# EAGLE design SUMO_AUTO (EAGLE 9.6.2)
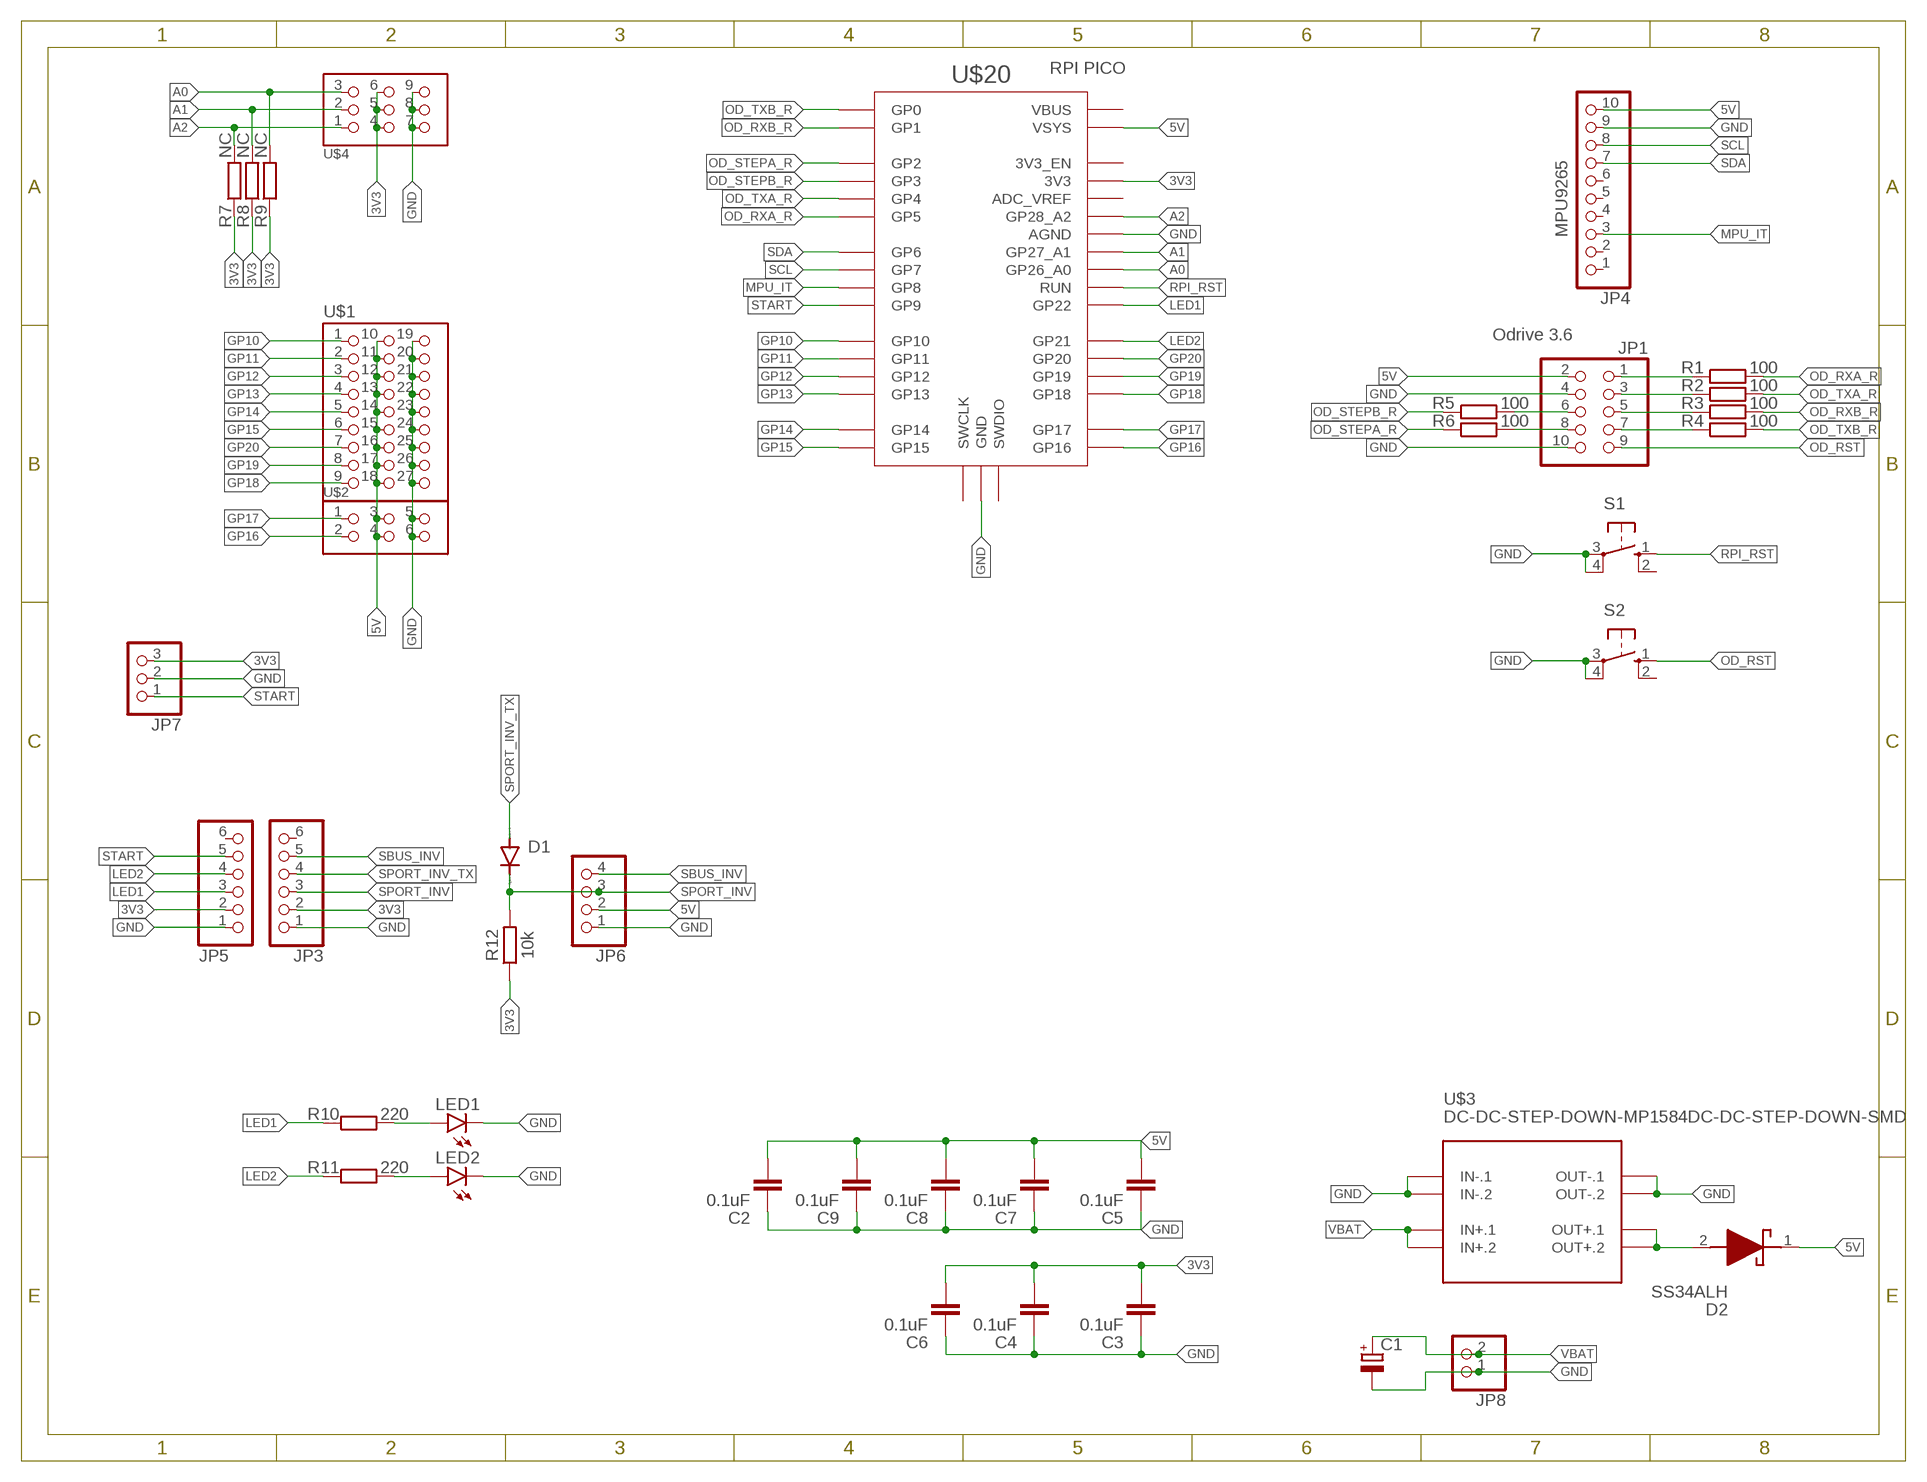
[diagram p0: schematic, sheet 1]

## Parts
C1  C-POL_TANTALUM-2920(7443-METRIC)  [CAPMP7443X430N]
C2  0.1uF  C_CHIP-0805(2012-METRIC)  [0805]
C3  0.1uF  C_CHIP-0805(2012-METRIC)  [0805]
C4  0.1uF  C_CHIP-0805(2012-METRIC)  [0805]
C5  0.1uF  C_CHIP-0805(2012-METRIC)  [0805]
C6  0.1uF  C_CHIP-0805(2012-METRIC)  [0805]
C7  0.1uF  C_CHIP-0805(2012-METRIC)  [0805]
C8  0.1uF  C_CHIP-0805(2012-METRIC)  [0805]
C9  0.1uF  C_CHIP-0805(2012-METRIC)  [0805]
D1  BAT81  [DO34-7]
D2  SS34ALH  [SODFL5226X100N]
JP1  PINHD-2X5  [2X05]
JP3  PINHD-1X6  [1X06]
JP4  PINHD-1X10  [1X10]
JP5  PINHD-1X6  [1X06]
JP6  PINHD-1X4  [1X04]
JP7  PINHD-1X3  [1X03]
JP8  PINHD-1X2  [1X02]
LED1  LEDCHIP-LED0805  [CHIP-LED0805]
LED2  LEDCHIP-LED0805  [CHIP-LED0805]
R1  100  R_CHIP-0805(2012-METRIC)  [0805]
R2  100  R_CHIP-0805(2012-METRIC)  [0805]
R3  100  R_CHIP-0805(2012-METRIC)  [0805]
R4  100  R_CHIP-0805(2012-METRIC)  [0805]
R5  100  R_CHIP-0805(2012-METRIC)  [0805]
R6  100  R_CHIP-0805(2012-METRIC)  [0805]
R7  NC  R_CHIP-0805(2012-METRIC)  [0805]
R8  NC  R_CHIP-0805(2012-METRIC)  [0805]
R9  NC  R_CHIP-0805(2012-METRIC)  [0805]
R10  220  R_CHIP-0805(2012-METRIC)  [0805]
R11  220  R_CHIP-0805(2012-METRIC)  [0805]
R12  10k  R_CHIP-0805(2012-METRIC)  [0805]
S1  10-XX  [B3F-10XX]
S2  10-XX  [B3F-10XX]
U$1  PIN_3X9  [PIN_3X9]
U$2  PIN_3X2  [PIN_3X2]
U$3  DC-DC-STEP-DOWN-MP1584DC-DC-STEP-DOWN-SMD  [DC-DC-STEP-DOWN-SMD]
U$4  PIN_3X3  [PIN_3X3]
U$20  RPI_PICO-SMD  [RPI_PICO]

## Nets
3V3: C3.2 C4.2 C6.2 JP3.2 JP5.2 JP7.3 R7.1 R8.1 R9.1 R12.1 U$4.4 U$4.5 U$4.6 U$20.3V3
5V: C2.2 C5.2 C7.2 C8.2 C9.2 D2.1(K) JP1.2 JP4.10 JP6.2 U$1.10 U$1.11 U$1.12 U$1.13 U$1.14 U$1.15 U$1.16 U$1.17 U$1.18 U$2.3 U$2.4 U$20.VSYS
5V_REG: D2.2(A) U$3.OUT+.1 U$3.OUT+.2
A0: R9.2 U$4.3 U$20.GP26_A0
A1: R8.2 U$4.2 U$20.GP27_A1
A2: R7.2 U$4.1 U$20.GP28_A2
GND: C1.2(-) C2.1 C3.1 C4.1 C5.1 C6.1 C7.1 C8.1 C9.1 JP1.4 JP1.10 JP3.1 JP4.9 JP5.1 JP6.1 JP7.2 JP8.1 LED1.C LED2.C S1.3(P) S1.4(P1) S2.3(P) S2.4(P1) U$1.19 U$1.20 U$1.21 U$1.22 U$1.23 U$1.24 U$1.25 U$1.26 U$1.27 U$2.5 U$2.6 U$3.IN-.1 U$3.IN-.2 U$3.OUT-.1 U$3.OUT-.2 U$4.7 U$4.8 U$4.9 U$20.AGND U$20.GND@1(GND) U$20.GND@2(GND) U$20.GND@3(GND) U$20.GND@4(GND) U$20.GND@5(GND) U$20.GND@6(GND) U$20.GND@7(GND) U$20.GND@8(GND)
GP10: U$1.1 U$20.GP10
GP11: U$1.2 U$20.GP11
GP12: U$1.3 U$20.GP12
GP13: U$1.4 U$20.GP13
GP14: U$1.5 U$20.GP14
GP15: U$1.6 U$20.GP15
GP16: U$2.2 U$20.GP16
GP17: U$2.1 U$20.GP17
GP18: U$1.9 U$20.GP18
GP19: U$1.8 U$20.GP19
GP20: U$1.7 U$20.GP20
LED1: JP5.3 R10.1 U$20.GP22
LED1R: LED1.A R10.2
LED2: JP5.4 R11.1 U$20.GP21
LED2R: LED2.A R11.2
MPU_IT: JP4.3 U$20.GP8
OD_RST: JP1.9 S2.1(S)
OD_RXA: JP1.1 R1.1
OD_RXA_R: R1.2 U$20.GP5
OD_RXB: JP1.5 R3.1
OD_RXB_R: R3.2 U$20.GP1
OD_STEPA: JP1.8 R6.2
OD_STEPA_R: R6.1 U$20.GP2
OD_STEPB: JP1.6 R5.2
OD_STEPB_R: R5.1 U$20.GP3
OD_TXA: JP1.3 R2.1
OD_TXA_R: R2.2 U$20.GP4
OD_TXB: JP1.7 R4.1
OD_TXB_R: R4.2 U$20.GP0
RPI_RST: S1.1(S) U$20.RUN
SBUS_INV: JP3.5 JP6.4
SCL: JP4.8 U$20.GP7
SDA: JP4.7 U$20.GP6
SPORT_INV: D1.C JP3.3 JP6.3 R12.2
SPORT_INV_TX: D1.A JP3.4
START: JP5.5 JP7.1 U$20.GP9
VBAT: C1.1(+) JP8.2 U$3.IN+.1 U$3.IN+.2
Unconnected: JP3.6 JP4.1 JP4.2 JP4.4 JP4.5 JP4.6 JP5.6 S1.2(S1) S2.2(S1) U$20.3V3_EN U$20.ADC_VREF U$20.SWCLK U$20.SWDIO U$20.VBUS

## Notes on the sheet
- RPI PICO
- MPU9265
- Odrive 3.6

## Library data of the parts
C1 = Capacitor_edit:C-POL: Capacitor Polarised - Generic; CATEGORY: Capacitor
C2-C9 = Capacitor_edit:C: Capacitor - Generic; CATEGORY: Capacitor; JLCPCB-PART: C14663
D1 = diode:BAT81: DIODE barrier diode
D2 = SS34ALH:SS34ALH: Schottky Diodes & Rectifiers 3A, 40V, Schottky Rectifier Source: Datasheet <https://services.ts.com.tw/storage/resources/datasheet/SS34ALH SERIES_B2103.pdf>; DESCRIPTION: Schottky Diodes & Rectifiers 3A, 40V, Schottky Rectifier; HEIGHT: 1mm; MANUFACTURER_NAME: Taiwan Semiconductor; MANUFACTURER_PART_NUMBER: SS34ALH; MOUSER_PART_NUMBER: 821-SS34ALH; MOUSER_PRICE-STOCK: https://www.mouser.co.uk/ProductDetail/Taiwan-Semiconductor/SS34ALH?qs=A6eO%252BMLsxmQip%2FrgNup6RA%3D%3D
JP1 = pinhead:PINHD-2X5: PIN HEADER
JP3 JP5 = pinhead:PINHD-1X6: PIN HEADER
JP4 = pinhead:PINHD-1X10: PIN HEADER
JP6 = pinhead:PINHD-1X4: PIN HEADER
JP7 = pinhead:PINHD-1X3: PIN HEADER
JP8 = pinhead:PINHD-1X2: PIN HEADER
LED1 LED2 = led:LED: LED OSRAM: - CHIPLED LG R971, LG N971, LY N971, LG Q971, LY Q971, LO R971, LY R971 LH N974, LH R974 LS Q976, LO Q976, LY Q976 LO Q996 - Hyper CHIPLED LW Q18S LB Q993, LB Q99A, LB R99A - SideLED LS A670, LO A670, LY A670, LG A670, LP A670 LB A673, LV A673, LT A673, LW A673 LH A674 LY A675 LS A676, LA A676, LO A676, LY A676, LW A676 LS A679, LY A679, LG A679 - Hyper Micro SIDELED® LS Y876, LA Y876, LO Y876, LY Y876 LT Y87S - SmartLED LW L88C, LW L88S LB L89C, LB L89S, LG L890 LS L89K, LO L89K, LY L89K LS L896, LA L896, LO L896, LY L896 - TOPLED LS T670, LO T670, LY T670, LG T670, LP T670 LSG T670, LSP T670, LSY T670, LOP T670, LYG T670 LG T671, LOG T671, LSG T671 LB T673, LV T673, LT T673, LW T673 LH T674 LS T676, LA T676, LO T676, LY T676, LB T676, LH T676, LSB T676, LW T676 LB T67C, LV T67C, LT T67C, LS T67K, LO T67K, LY T67K, LW E67C LS E67B, LA E67B, LO E67B, LY E67B, LB E67C, LV E67C, LT E67C LW T67C LS T679, LY T679, LG T679 LS T770, LO T770, LY T770, LG T770, LP T770 LB T773, LV T773, LT T773, LW T773 LH T774 LS E675, LA E675, LY E675, LS T675 LS T776, LA T776, LO T776, LY T776, LB T776 LHGB T686 LT T68C, LB T68C - Hyper Mini TOPLED® LB M676 - Mini TOPLED Santana® LG M470 LS M47K, LO M47K, LY M47K Source: http://www.osram.convergy.de LUXEON: - LUMILED® LXK2-PW12-R00, LXK2-PW12-S00, LXK2-PW14-U00, LXK2-PW14-V00 LXK2-PM12-R00, LXK2-PM12-S00, LXK2-PM14-U00 LXK2-PE12-Q00, LXK2-PE12-R00, LXK2-PE12-S00, LXK2-PE14-T00, LXK2-PE14-U00 LXK2-PB12-K00, LXK2-PB12-L00, LXK2-PB12-M00, LXK2-PB14-N00, LXK2-PB14-P00, LXK2-PB14-Q00 LXK2-PR12-L00, LXK2-PR12-M00, LXK2-PR14-Q00, LXK2-PR14-R00 LXK2-PD12-Q00, LXK2-PD12-R00, LXK2-PD12-S00 LXK2-PH12-R00, LXK2-PH12-S00 LXK2-PL12-P00, LXK2-PL12-Q00, LXK2-PL12-R00 Source: www.luxeon.com KINGBRIGHT: KA-3528ASYC Source: www.kingbright.com
R1-R12 = Resistor_edit:R: Resistor Fixed - Generic; CATEGORY: Resistor; SUB-CATEGORY: Fixed
S1 S2 = switch-omron:10-XX: OMRON SWITCH; MPN: B3F-1000; OC_FARNELL: 176432; OC_NEWARK: 36M3542
U$1 = pinhead_3row:PIN_3X9
U$2 = pinhead_3row:PIN_3X2
U$3 = 00_personal:DC-DC-STEP-DOWN-MP1584: DC/DC Step-Down Regulator based on MP1584 chip MP1584 datasheet available here: http://www.haoyuelectronics.com/Attachment/MP1584/MP1584.pdf Click here to find device on ebay.com <http://www.ebay.com/sch/mp1584+module>
U$4 = pinhead_3row:PIN_3X3
U$20 = RaspberryPi_Pico:RPI_PICO

## Board
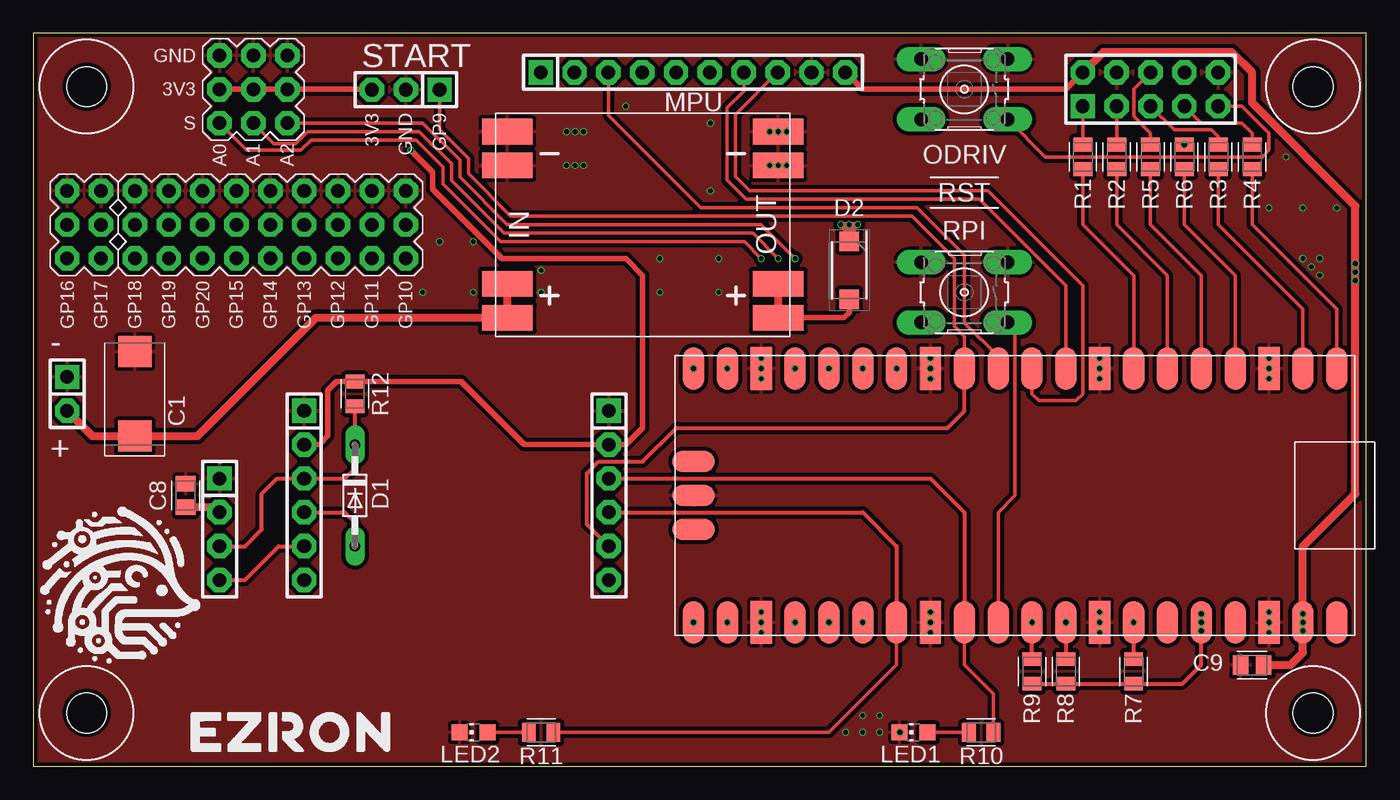
[diagram p1: board, top side]
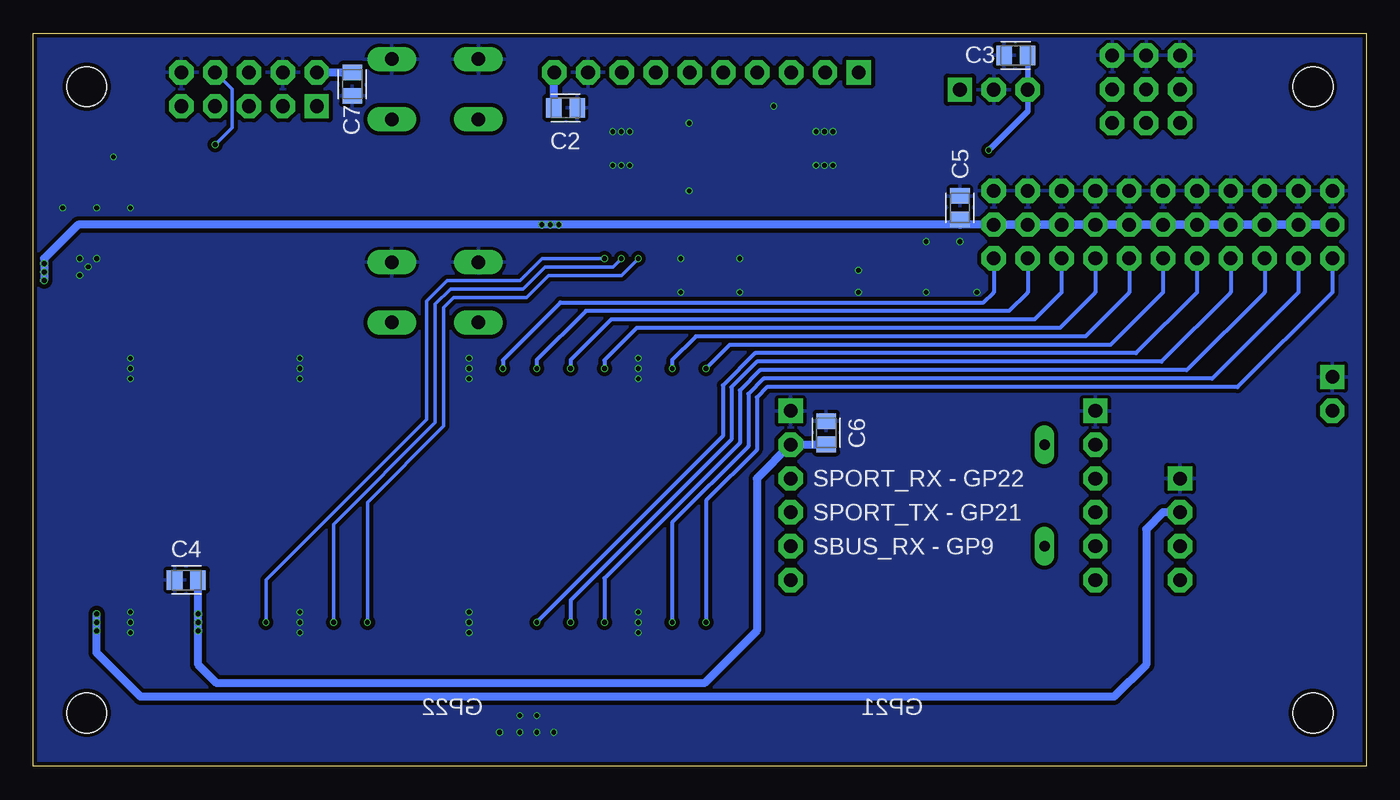
[diagram p2: board, bottom side, seen from below]

Size 100 x 55 mm. Coordinates in mm from the lower left corner, seen from the top.
Outline: 100,0 100,55 0,55 0,0 100,0
Copper layers (1*16): Top 0.035mm / dielectric 1.6mm / Bottom 0.035mm
Design rules "PCBway *": minimum track width 5mil, minimum drill 0.3mm, track to track 6mil, track to pad 6mil, pad to pad 6mil, via to via 6mil, smd to smd 6mil, copper to edge 0.3mm, drill to drill 6mil, minimum pad ring 10mil, minimum via ring 3mil, stop-mask expansion 4mil, vias tented up to drill 15mil, thermal gap 10mil
Holes 3 mm at 4,51 4,4 96,4 96,51

### Footprints (pad centres in the part's own frame; a part is rotated, then mirrored left to right if it is on the bottom)
CAPMP7443X430N = smd 2.333 x 2.515: 1 -3.166,0; 2 3.166,0
0805 = smd 1.165 x 1.465: 1 -0.875,0; 2 0.875,0
DO34-7 = drill 0.813 long: A 3.81,0; C -3.81,0
SODFL5226X100N = smd 1.45 x 1.49: 1 -2.175,0; 2 2.175,0
2X05 = drill 1.016 square: 1 -5.08,-1.27 | drill 1.016 octagon: 2 -5.08,1.27; 3 -2.54,-1.27; 4 -2.54,1.27; 5 0,-1.27; 6 0,1.27; 7 2.54,-1.27; 8 2.54,1.27; 9 5.08,-1.27; 10 5.08,1.27
1X06 = drill 1.016 square: 1 -6.35,0 | drill 1.016 octagon: 2 -3.81,0; 3 -1.27,0; 4 1.27,0; 5 3.81,0; 6 6.35,0
1X10 = drill 1.016 square: 1 -11.43,0 | drill 1.016 octagon: 2 -8.89,0; 3 -6.35,0; 4 -3.81,0; 5 -1.27,0; 6 1.27,0; 7 3.81,0; 8 6.35,0; 9 8.89,0; 10 11.43,0
1X04 = drill 1.016 square: 1 -3.81,0 | drill 1.016 octagon: 2 -1.27,0; 3 1.27,0; 4 3.81,0
1X03 = drill 1.016 square: 1 -2.54,0 | drill 1.016 octagon: 2 0,0; 3 2.54,0
1X02 = drill 1.016 square: 1 -1.27,0 | drill 1.016 octagon: 2 1.27,0
CHIP-LED0805 = smd 1.2 x 1.2: A 0,-1.05; C 0,1.05
0805' = smd 1.031 x 1.42: 1 -0.919,0; 2 0.919,0
B3F-10XX = drill 1.016 long: 1 -3.251,2.261; 2 3.251,2.261; 3 -3.251,-2.261; 4 3.251,-2.261
PIN_3X9 = drill 1.016 octagon: 1 1.27,-1.27; 2 3.81,-1.27; 3 6.35,-1.27; 4 8.89,-1.27; 5 11.43,-1.27; 6 13.97,-1.27; 7 16.51,-1.27; 8 19.05,-1.27; 9 21.59,-1.27; 10 1.27,-3.81; 11 3.81,-3.81; 12 6.35,-3.81; 13 8.89,-3.81; 14 11.43,-3.81; 15 13.97,-3.81; 16 16.51,-3.81; 17 19.05,-3.81; 18 21.59,-3.81; 19 1.27,-6.35; 20 3.81,-6.35; 21 6.35,-6.35; 22 8.89,-6.35; 23 11.43,-6.35; 24 13.97,-6.35; 25 16.51,-6.35; 26 19.05,-6.35; 27 21.59,-6.35
PIN_3X2 = drill 1.016 octagon: 1 1.27,-1.27; 2 3.81,-1.27; 3 1.27,-3.81; 4 3.81,-3.81; 5 1.27,-6.35; 6 3.81,-6.35
DC-DC-STEP-DOWN-SMD = smd 3.81 x 1.93: IN+.1 -10.16,-4.445; IN+.2 -10.16,-6.985; IN-.1 -10.16,6.985; IN-.2 -10.16,4.445; OUT+.1 10.16,-4.445; OUT+.2 10.16,-6.985; OUT-.1 10.16,6.985; OUT-.2 10.16,4.445
PIN_3X3 = drill 1.016 octagon: 1 1.27,-1.27; 2 3.81,-1.27; 3 6.35,-1.27; 4 1.27,-3.81; 5 3.81,-3.81; 6 6.35,-3.81; 7 1.27,-6.35; 8 3.81,-6.35; 9 6.35,-6.35
RPI_PICO = smd 3.2 x 1.6: 3V3 9.525,13.97; 3V3_EN 9.525,16.51; ADC_VREF 9.525,11.43; AGND 9.525,6.35; GND@1 -9.525,19.05; GND@2 -9.525,6.35; GND@3 -9.525,-6.35; GND@4 -9.525,-19.05; GND@6 9.525,-19.05; GND@7 9.525,-6.35; GND@8 9.525,19.05; GP0 -9.525,24.13; GP1 -9.525,21.59; GP2 -9.525,16.51; GP3 -9.525,13.97; GP4 -9.525,11.43; GP5 -9.525,8.89; GP6 -9.525,3.81; GP7 -9.525,1.27; GP8 -9.525,-1.27; GP9 -9.525,-3.81; GP10 -9.525,-8.89; GP11 -9.525,-11.43; GP12 -9.525,-13.97; GP13 -9.525,-16.51; GP14 -9.525,-21.59; GP15 -9.525,-24.13; GP16 9.525,-24.13; GP17 9.525,-21.59; GP18 9.525,-16.51; GP19 9.525,-13.97; GP20 9.525,-11.43; GP21 9.525,-8.89; GP22 9.525,-3.81; GP26_A0 9.525,1.27; GP27_A1 9.525,3.81; GP28_A2 9.525,8.89; RUN 9.525,-1.27; VBUS 9.525,24.13; VSYS 9.525,21.59 | smd 1.6 x 3.2: GND@5 0,-24.13; SWCLK -2.54,-24.13; SWDIO 2.54,-24.13

### Placement (x,y rotation side)
C1  7.62,27.94 90 top
C2  60.07,49.4 180 bottom
C3  26.29,53.34 0 bottom
C4  88.52,13.97 0 bottom
C5  30.48,41.91 270 bottom
C6  40.51,25.02 270 bottom
C7  76.07,51.18 90 bottom
C8  11.43,20.32 270 top
C9  91.44,7.59 0 top
D1  24.13,20.32 270 top
D2  61.21,37.21 270 top
JP1  83.82,50.8 0 top
JP3  20.32,20.32 270 top
JP4  49.49,52.07 0 top
JP5  43.18,20.32 270 top
JP6  13.97,17.78 270 top
JP7  27.94,50.77 180 top
JP8  2.54,27.94 270 top
LED1  66.04,2.54 90 top
LED2  33.02,2.54 90 top
R1  100  [0805']  78.74,45.72 270 top
R2  100  [0805']  81.28,45.72 270 top
R3  100  [0805']  88.9,45.72 270 top
R4  100  [0805']  91.44,45.72 270 top
R5  100  [0805']  83.82,45.72 90 top
R6  100  [0805']  86.36,45.72 90 top
R7  NC  [0805']  82.55,7.11 90 top
R8  NC  [0805']  77.47,7.11 90 top
R9  NC  [0805']  74.93,7.11 90 top
R10  220  [0805']  71.12,2.54 180 top
R11  220  [0805']  38.1,2.54 180 top
R12  10k  [0805']  24.13,27.94 270 top
S1  69.85,35.56 180 top
S2  69.85,50.8 180 top
U$1  29.21,36.83 180 top
U$2  6.35,36.83 180 top
U$3  45.72,40.64 0 top
U$4  20.32,46.99 180 top
U$20  73.66,20.32 270 top

### Tracks (layer width: path | path; a pad name or v marks a point on that pad's centre or on a via)
3V3  (via drill 0.35)
  Top 0.305: R9.1 R8.1 R7.1 86.2,6.19 87.63,7.62 v87.63,10.16 U$20.3V3
  Top 0.406: JP3.2 21.46,24.13 22.1,24.77 22.1,28.19 22.76,28.86 R12.1 32.1,28.86 36.83,24.13 JP5.2 44.45,24.13 45.72,25.4 45.72,36.83 44.45,38.1 35.18,38.1 29.97,43.31 29.97,44.58 v28.32,46.23 | U$4.6 U$4.5 U$4.4 25.37,50.8 JP7.3
  Top 0.61: v87.63,11.43 U$20.3V3
  Bottom 0.406: v28.32,46.23 25.4,49.15 JP7.3 25.4,53.33
  Bottom 0.61: C6.2 43.17,24.14 JP5.2 45.72,21.59 45.72,10.16 49.66,6.22 86.23,6.22 87.63,7.62 v87.63,10.16 U$20.3V3 v87.63,11.43 87.64,11.44 C4.2 | 25.4,53.33 C3.2
  other vias: 87.63,10.79
5V  (via drill 0.35)
  Top 0.406: JP4.10 62.19,50.8 77.47,50.8 JP1.2 | v61.21,40.64 D2.1 61.21,40.01 | 61.21,40.01 v60.58,40.64 v61.21,40.64 | 61.21,40.01 v61.85,40.64 v61.21,40.64
  Top 0.61: JP1.2 80.26,53.59 89.92,53.59 91.44,52.07 91.44,49.78 99.19,42.04 v99.19,37.72 v99.19,37.08 v99.19,36.45 99.19,20.45 95.25,16.51 v95.25,11.43 U$20.VSYS v95.25,10.16 95.25,8.51 94.33,7.59 C9.2 | C8.2 13.57,19.45 JP6.2
  Bottom 0.406: C2.2 60.95,49.53
  Bottom 0.61: U$1.10 30.48,40.64 | 30.48,40.64 v60.58,40.64 v61.21,40.64 v61.85,40.64 96.65,40.64 99.19,38.1 v99.19,37.72 v99.19,37.08 v99.19,36.45 | C5.2 30.48,40.64 | C2.2 60.95,52.05 JP4.10 | C7.2 78.73,52.06 JP1.2 | JP6.2 15.24,19.05 16.51,17.78 16.51,7.62 18.92,5.21 91.95,5.21 95.25,8.51 v95.25,10.16 U$20.VSYS v95.25,11.43
  Bottom 0.635: U$2.4 U$2.3 U$1.18 U$1.17 U$1.16 U$1.15 U$1.14 U$1.13 U$1.12 U$1.11 U$1.10
  other vias: 95.25,10.79
5V_REG
  Top 0.305: 55.88,33.91 U$3.OUT+.2
  Top 0.406: U$3.OUT+.2 60.83,33.66 61.21,34.04 D2.2
  Top 0.61: U$3.OUT+.1 55.88,33.91
A0  (via drill 0.35)
  Top 0.254: v54.61,38.1 53.34,39.37 35.05,39.37 30.73,43.69 30.73,44.96 28.7,46.99 20.83,46.99 20.07,46.23 16,46.23 U$4.3
  Top 0.305: R9.2 U$20.GP26_A0
  Bottom 0.254: v54.61,38.1 55.88,36.83 61.34,36.83 62.99,35.18 68.45,35.18 69.22,34.42 69.22,25.53 74.93,19.81 U$20.GP26_A0
  other vias: 74.93,10.79
A1  (via drill 0.35)
  Top 0.254: v55.88,38.1 53.98,40.01 35.31,40.01 31.37,43.94 31.37,45.21 28.96,47.62 20.57,47.62 19.68,46.74 18.03,46.74 U$4.2
  Top 0.305: U$20.GP27_A1 R8.2
  Bottom 0.254: v55.88,38.1 56.52,37.47 61.59,37.47 63.25,35.81 68.71,35.81 69.85,34.67 69.85,25.78 77.47,18.16 U$20.GP27_A1
  other vias: 77.47,10.79
A2  (via drill 0.35)
  Top 0.254: v57.15,38.1 54.61,40.64 35.56,40.64 32,44.2 32,45.47 29.21,48.26 U$4.1
  Top 0.305: R7.2 U$20.GP28_A2
  Bottom 0.254: v57.15,38.1 61.85,38.1 63.5,36.45 68.96,36.45 70.48,34.92 70.48,26.04 82.55,13.97 U$20.GP28_A2
  other vias: 82.55,10.79
GND  (via drill 0.35)
  other vias: 54.61,10.79 54.61,29.84 92.71,29.84 92.71,10.79 40.64,45.09 40.64,47.62 40.01,45.09 41.27,45.09 40.01,47.62 41.27,47.62 55.88,47.62 55.24,47.62 56.52,47.62 55.88,45.09 56.52,45.09 55.24,45.09 95.25,38.1 95.89,37.47 96.52,36.83 96.52,38.1 92.71,41.91 97.79,41.91 95.25,41.91 93.98,45.72 92.71,30.61 92.71,29.08 67.31,29.84 67.31,30.61 67.31,29.08 54.61,29.08 54.61,30.61 54.61,10.03 54.61,11.56 67.31,10.79 67.31,10.03 67.31,11.56 80.01,10.79 80.01,11.56 80.01,10.03 92.71,11.56 92.71,10.03 29.21,35.56 30.48,39.37 33.02,39.37 33.02,35.56 38.1,35.56 38.1,37.21 44.45,49.53 50.8,43.18 50.8,48.26 46.99,38.1 46.99,35.56 51.44,38.1 51.44,35.56 65.02,2.54 62.23,3.81 60.96,2.54 62.23,2.54 63.5,2.54 63.5,3.81 80.01,29.84 80.01,29.08 80.01,30.61
  pour Bottom (isolate 0.305): -1.4,55.88 -1.4,-1.27 101.6,-1.27 101.6,55.88
  pour Top (isolate 0.305): -1.4,55.88 -1.4,-1.27 101.6,-1.27 101.6,55.88
GP10  (via drill 0.35)
  Bottom 0.305: U$1.1 27.94,35.56 28.7,34.8 60.45,34.8 64.77,30.48 U$20.GP10
  other vias: 64.77,29.84
GP11  (via drill 0.35)
  Bottom 0.305: U$1.2 25.4,35.56 26.8,34.16 58.55,34.16 62.23,30.48 U$20.GP11
  other vias: 62.23,29.84
GP12  (via drill 0.35)
  Bottom 0.305: U$1.3 22.86,35.56 24.89,33.53 56.64,33.53 59.69,30.48 U$20.GP12
  other vias: 59.69,29.84
GP13  (via drill 0.35)
  Bottom 0.305: U$1.4 20.32,35.56 22.99,32.89 54.74,32.89 57.15,30.48 U$20.GP13
  other vias: 57.15,29.84
GP14  (via drill 0.35)
  Bottom 0.305: U$1.5 17.78,35.56 21.08,32.26 50.29,32.26 52.07,30.48 U$20.GP14
  other vias: 52.07,29.84
GP15  (via drill 0.35)
  Bottom 0.305: U$1.6 15.24,35.56 19.18,31.62 47.75,31.62 U$20.GP15
  other vias: 49.53,29.84
GP16  (via drill 0.35)
  Bottom 0.305: U$2.2 2.54,35.56 9.65,28.45 44.96,28.45 45.72,27.69 45.72,23.75 49.53,19.94 U$20.GP16
  other vias: 49.53,10.79
GP17  (via drill 0.35)
  Bottom 0.305: U$2.1 5.08,35.56 11.56,29.08 45.21,29.08 46.35,27.94 46.35,24 52.07,18.29 U$20.GP17
  other vias: 52.07,10.79
GP18  (via drill 0.35)
  Bottom 0.305: U$1.9 7.62,35.56 13.46,29.72 45.47,29.72 46.99,28.19 46.99,24.26 57.15,14.1 U$20.GP18
  other vias: 57.15,10.79
GP19  (via drill 0.35)
  Bottom 0.305: U$1.8 10.16,35.56 15.37,30.35 45.72,30.35 47.62,28.45 47.62,24.51 59.69,12.45 U$20.GP19
  other vias: 59.69,10.79
GP20  (via drill 0.35)
  Bottom 0.305: U$1.7 12.7,35.56 17.27,30.99 45.85,30.99 48.26,28.57 48.26,24.77 U$20.GP20
  other vias: 62.23,10.79
LED1
  Top 0.254: R10.1 72.04,5.43 69.85,7.62 U$20.GP22
  Top 0.305: JP5.3 67.31,21.59 69.85,19.05 U$20.GP22
LED1R
  Top 0.254: LED1.A R10.2
LED2
  Top 0.254: U$20.GP21 64.77,10.67 64.77,7.62 59.69,2.54 R11.1
  Top 0.305: JP5.4 62.23,19.05 64.77,16.51 64.77,10.67
LED2R
  Top 0.254: LED2.A R11.2
MPU_IT
  Top 0.254: U$20.GP8 72.39,30.73 69.85,33.27 69.85,38.35 66.29,41.91 50.04,41.91 43.14,48.81 JP4.3
OD_RST
  Top 0.254: S2.1 75.92,45.72 92.2,45.72 92.71,46.23 92.71,47.5 90.68,49.53 JP1.9
OD_RXA
  Top 0.254: JP1.1 R1.1
OD_RXA_R
  Top 0.254: R1.2 78.74,40.64 82.55,36.83 U$20.GP5
OD_RXB
  Top 0.254: JP1.5 85.6,47.75 88.39,47.75 88.9,47.24 R3.1
OD_RXB_R
  Top 0.254: R3.2 88.9,40.64 95.25,34.29 U$20.GP1
OD_STEPA  (via drill 0.35)
  Bottom 0.254: JP1.8 85.09,50.8 85.09,47.91 R6.2
  other vias: 86.36,46.64
OD_STEPA_R
  Top 0.254: R6.1 86.36,40.64 90.17,36.83 U$20.GP2
OD_STEPB
  Top 0.254: JP1.6 82.55,50.8 82.55,48.77 83.82,47.5 R5.2
OD_STEPB_R
  Top 0.254: R5.1 83.82,40.64 87.63,36.83 U$20.GP3
OD_TXA
  Top 0.254: JP1.3 R2.1
OD_TXA_R
  Top 0.254: R2.2 81.28,40.64 85.09,36.83 U$20.GP4
OD_TXB
  Top 0.254: JP1.7 87.63,48.26 90.68,48.26 91.44,47.5 R4.1
OD_TXB_R
  Top 0.254: R4.2 91.44,40.64 97.79,34.29 U$20.GP0
RPI_RST
  Top 0.254: S1.1 73.66,32.74 73.66,20.32 72.39,19.05 U$20.RUN
SBUS_INV
  Top 0.305: JP6.4 15.88,13.97 18.41,16.51 JP3.5
SCL
  Top 0.254: U$20.GP7 74.93,27.94 75.44,27.43 78.23,27.43 78.74,27.94 78.74,36.07 71.63,43.18 53.72,43.18 52.67,44.23 52.67,48.9 JP4.8
SDA
  Top 0.254: U$20.GP6 77.47,36.07 70.99,42.55 53.47,42.55 52.03,43.98 52.03,49.4 53.3,50.67 JP4.7
SPORT_INV
  Top 0.305: JP6.3 15.88,16.51 17.14,17.78 17.14,20.45 18.29,21.59 JP3.3 23.37,21.59 24.13,22.35 D1.C R12.2
SPORT_INV_TX
  Top 0.305: JP3.4 23.37,19.05 24.13,18.29 D1.A
START
  Top 0.254: U$20.GP9 69.85,29.97 69.85,32.26 69.09,33.02 69.09,38.1 65.91,41.27 35.81,41.27 32.64,44.45 32.64,45.59 30.48,47.75 JP7.1
  Top 0.305: JP5.5 41.53,18.16 41.53,21.97 42.42,22.86 45.72,22.86 48.26,25.4 68.58,25.4 69.85,26.67 69.85,29.97
VBAT
  Top 0.61: U$3.IN+.1 U$3.IN+.2 21.21,33.66 12.33,24.77 C1.1 4.44,24.77 JP8.2

### Text on the board
tNames: START | GND / 3V3 / S | MPU | 3V3 / GND / GP9 | A0 / A1 / A2 | ODRIV / RST / RPI | GP16 / GP17 / GP18 / GP19 / GP20 / GP15 / GP14 / GP13 / GP12 / GP11 / GP10 | - | +
bNames: SPORT_RX - GP22 / SPORT_TX - GP21 / SBUS_RX - GP9 | GP21 | GP22